# EAGLE schematic SmartTraffic (EAGLE 9.6.2)
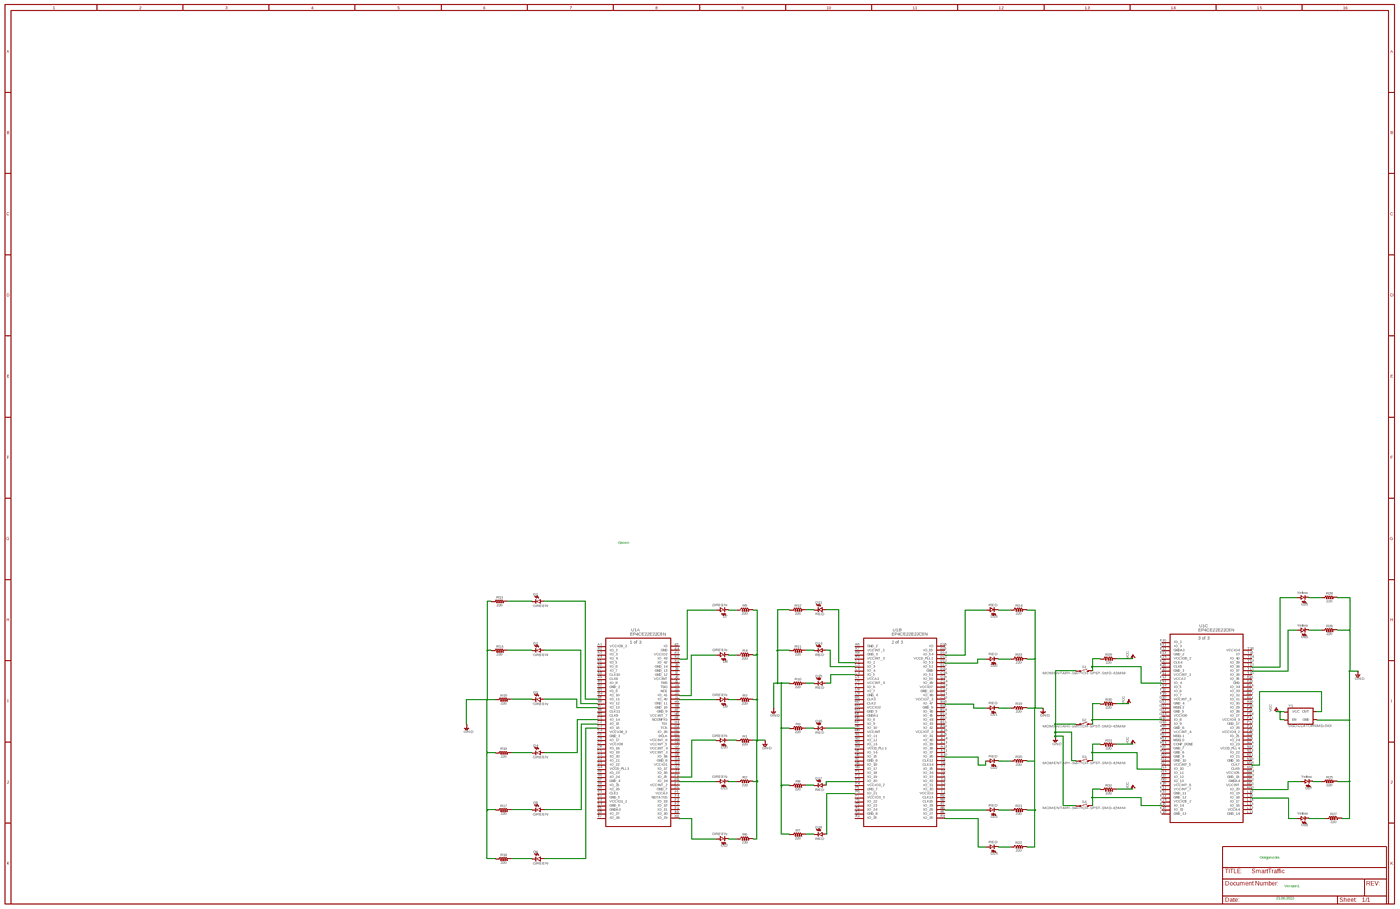
[diagram p0: schematic, sheet 1, overview]
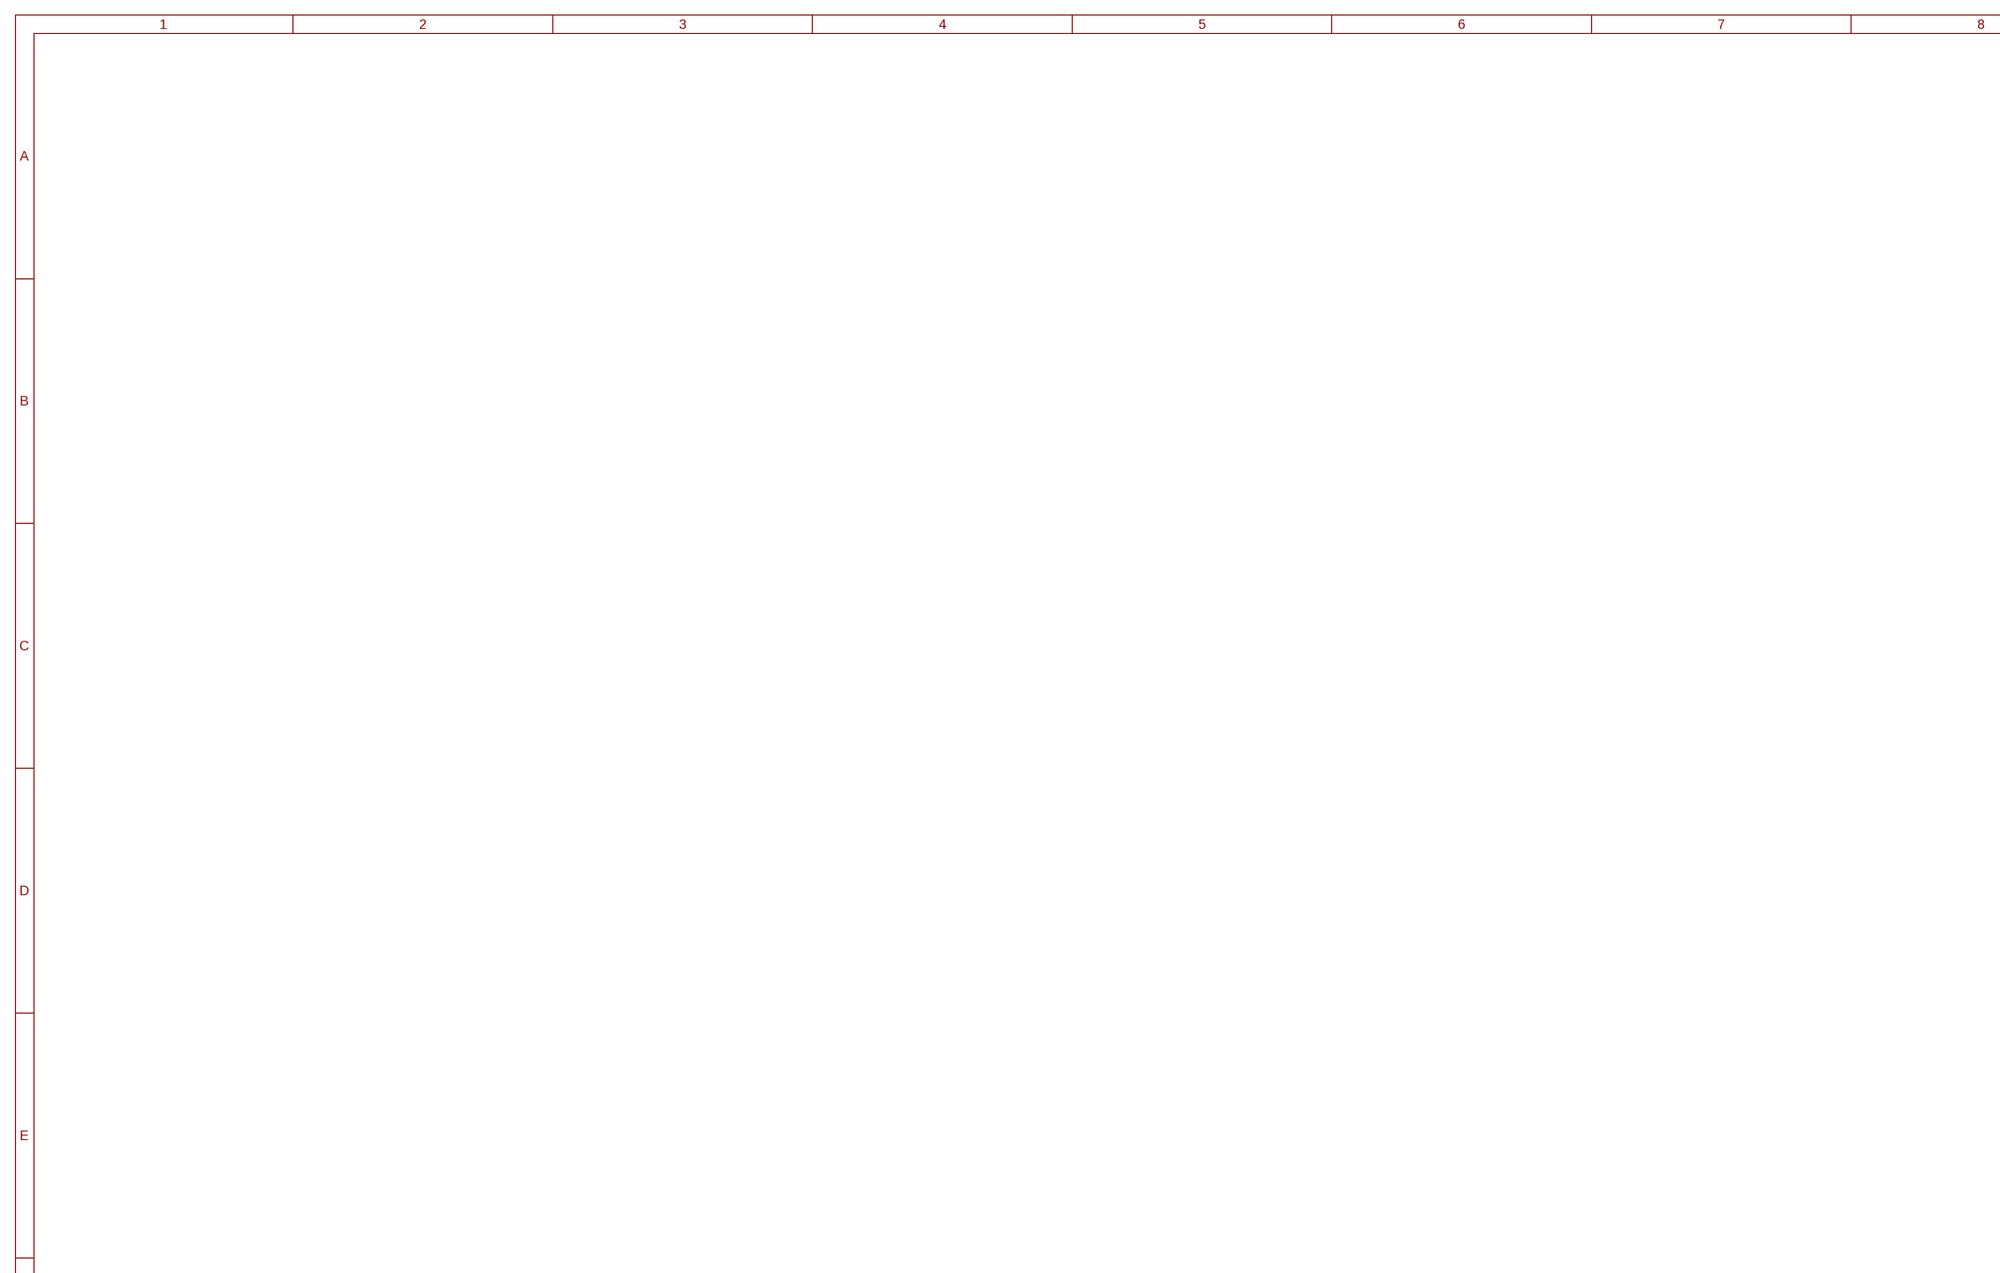
[diagram p1: schematic, sheet 1, part 1 of 4]
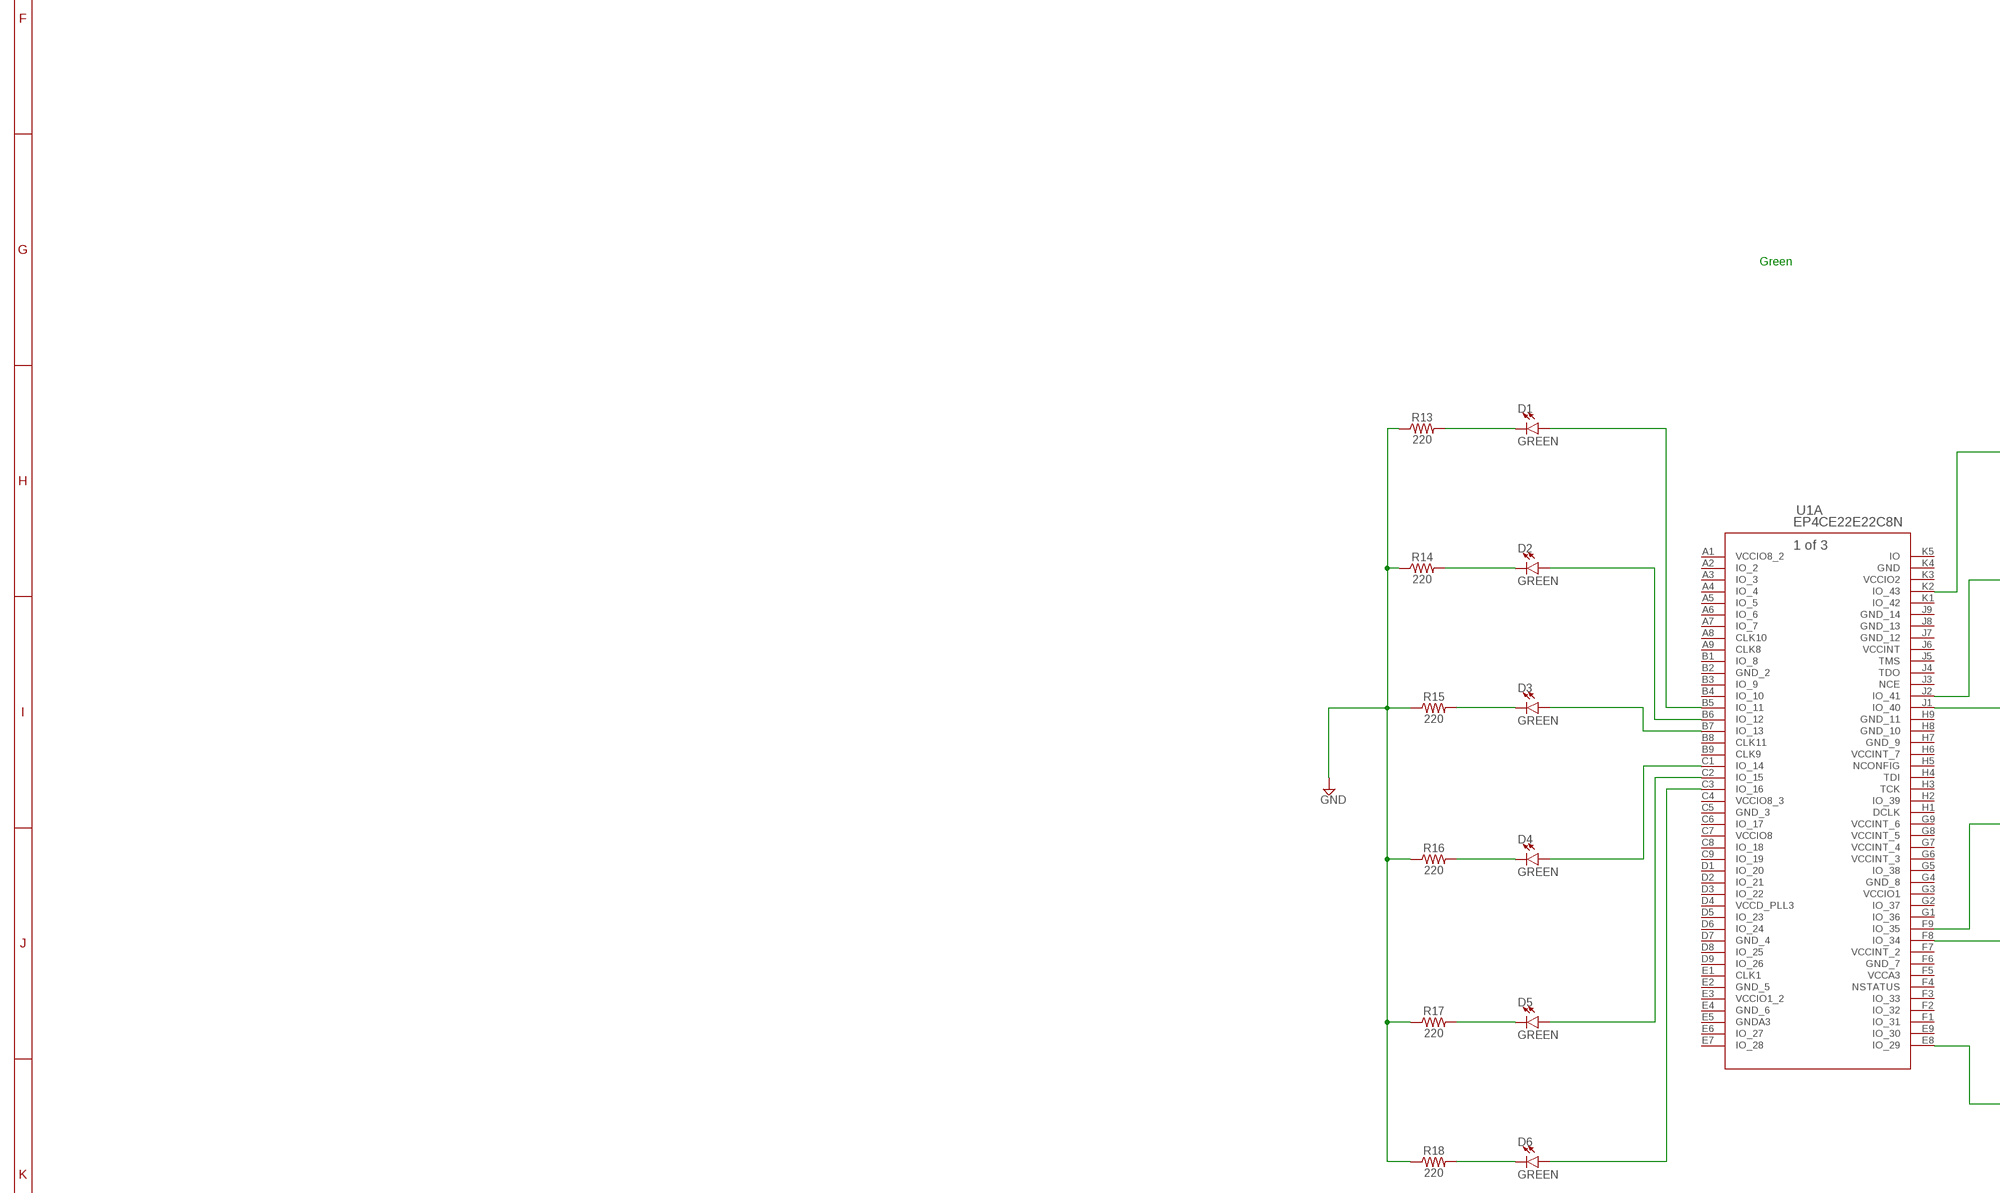
[diagram p2: schematic, sheet 1, part 2 of 4]
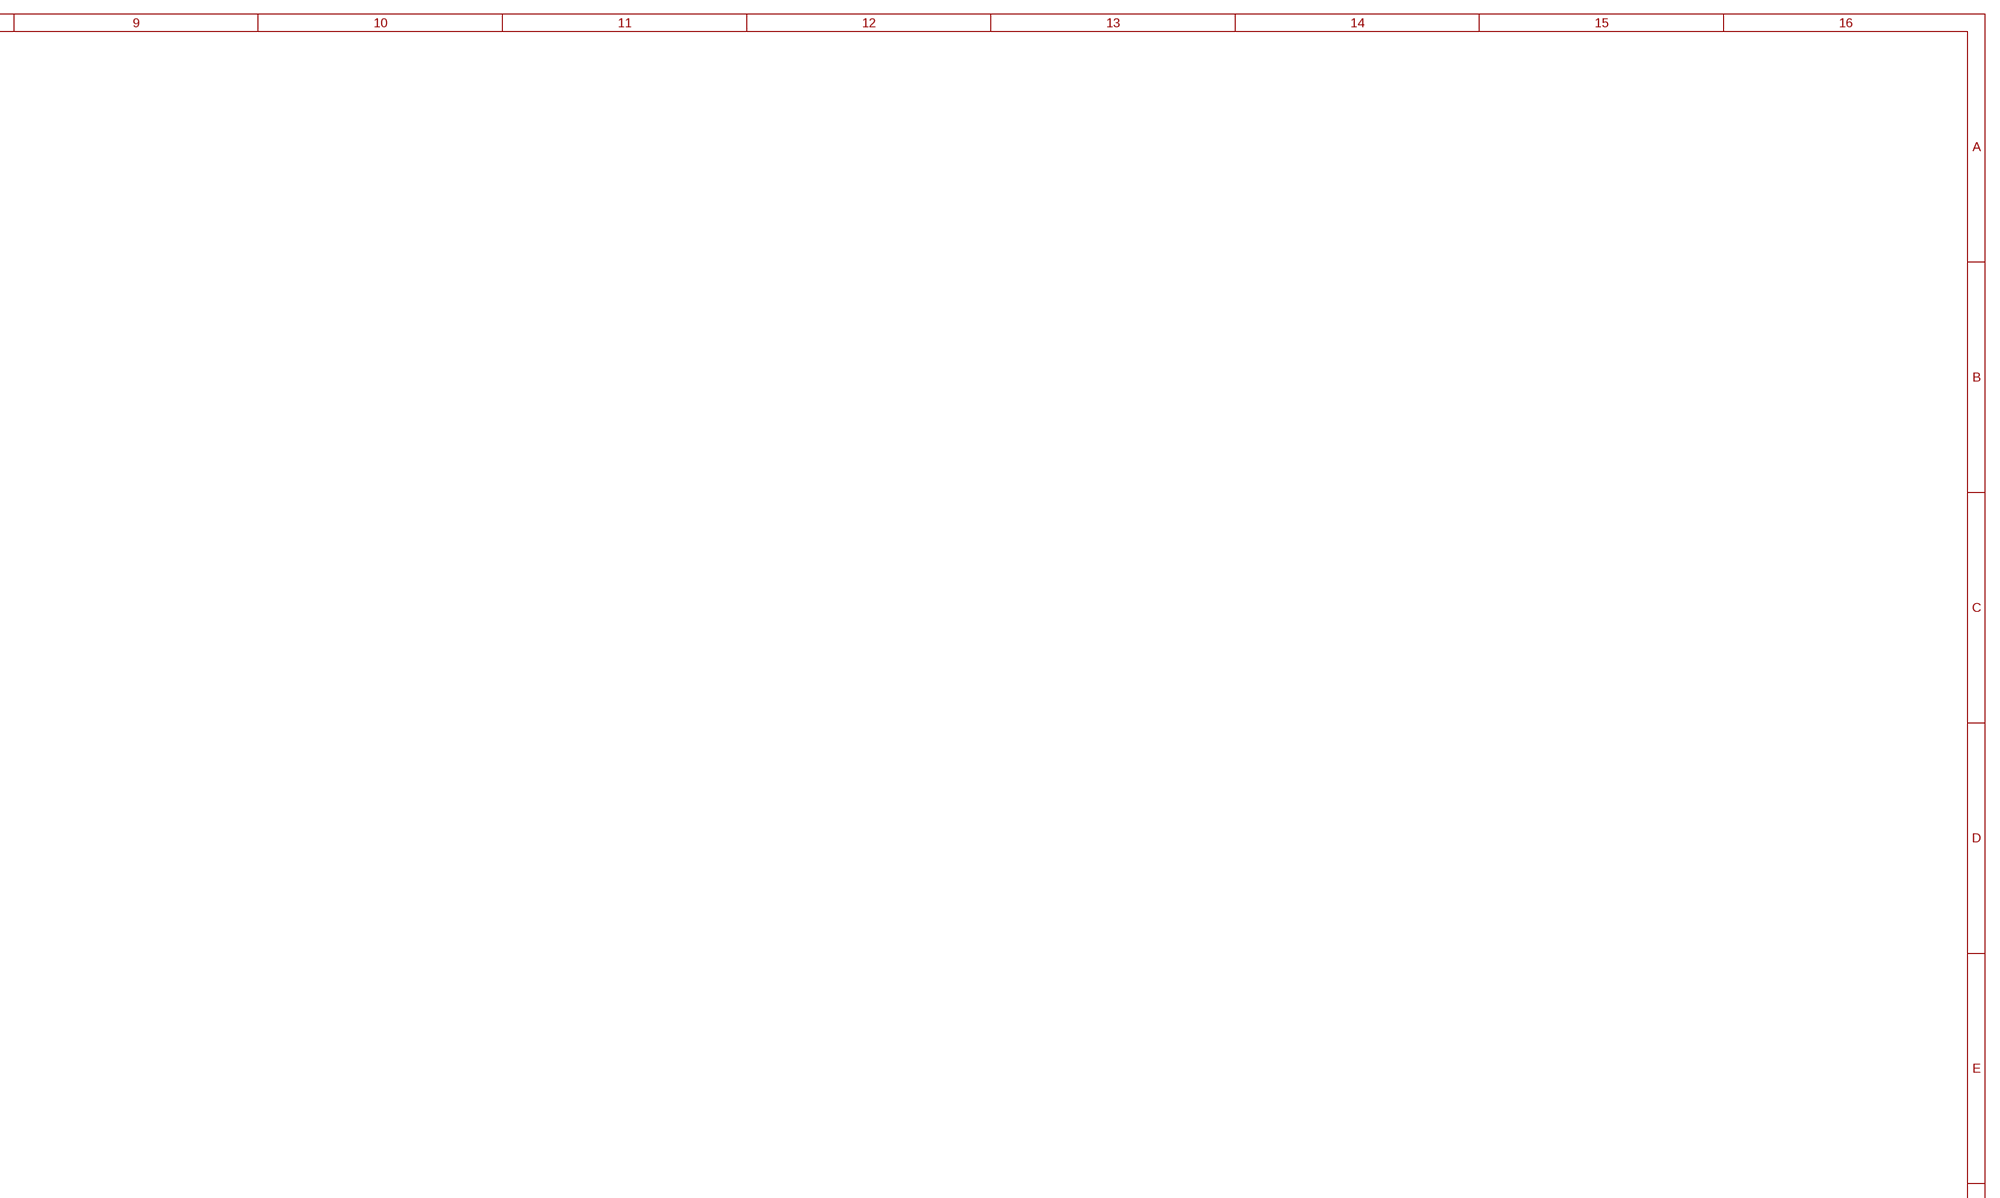
[diagram p3: schematic, sheet 1, part 3 of 4]
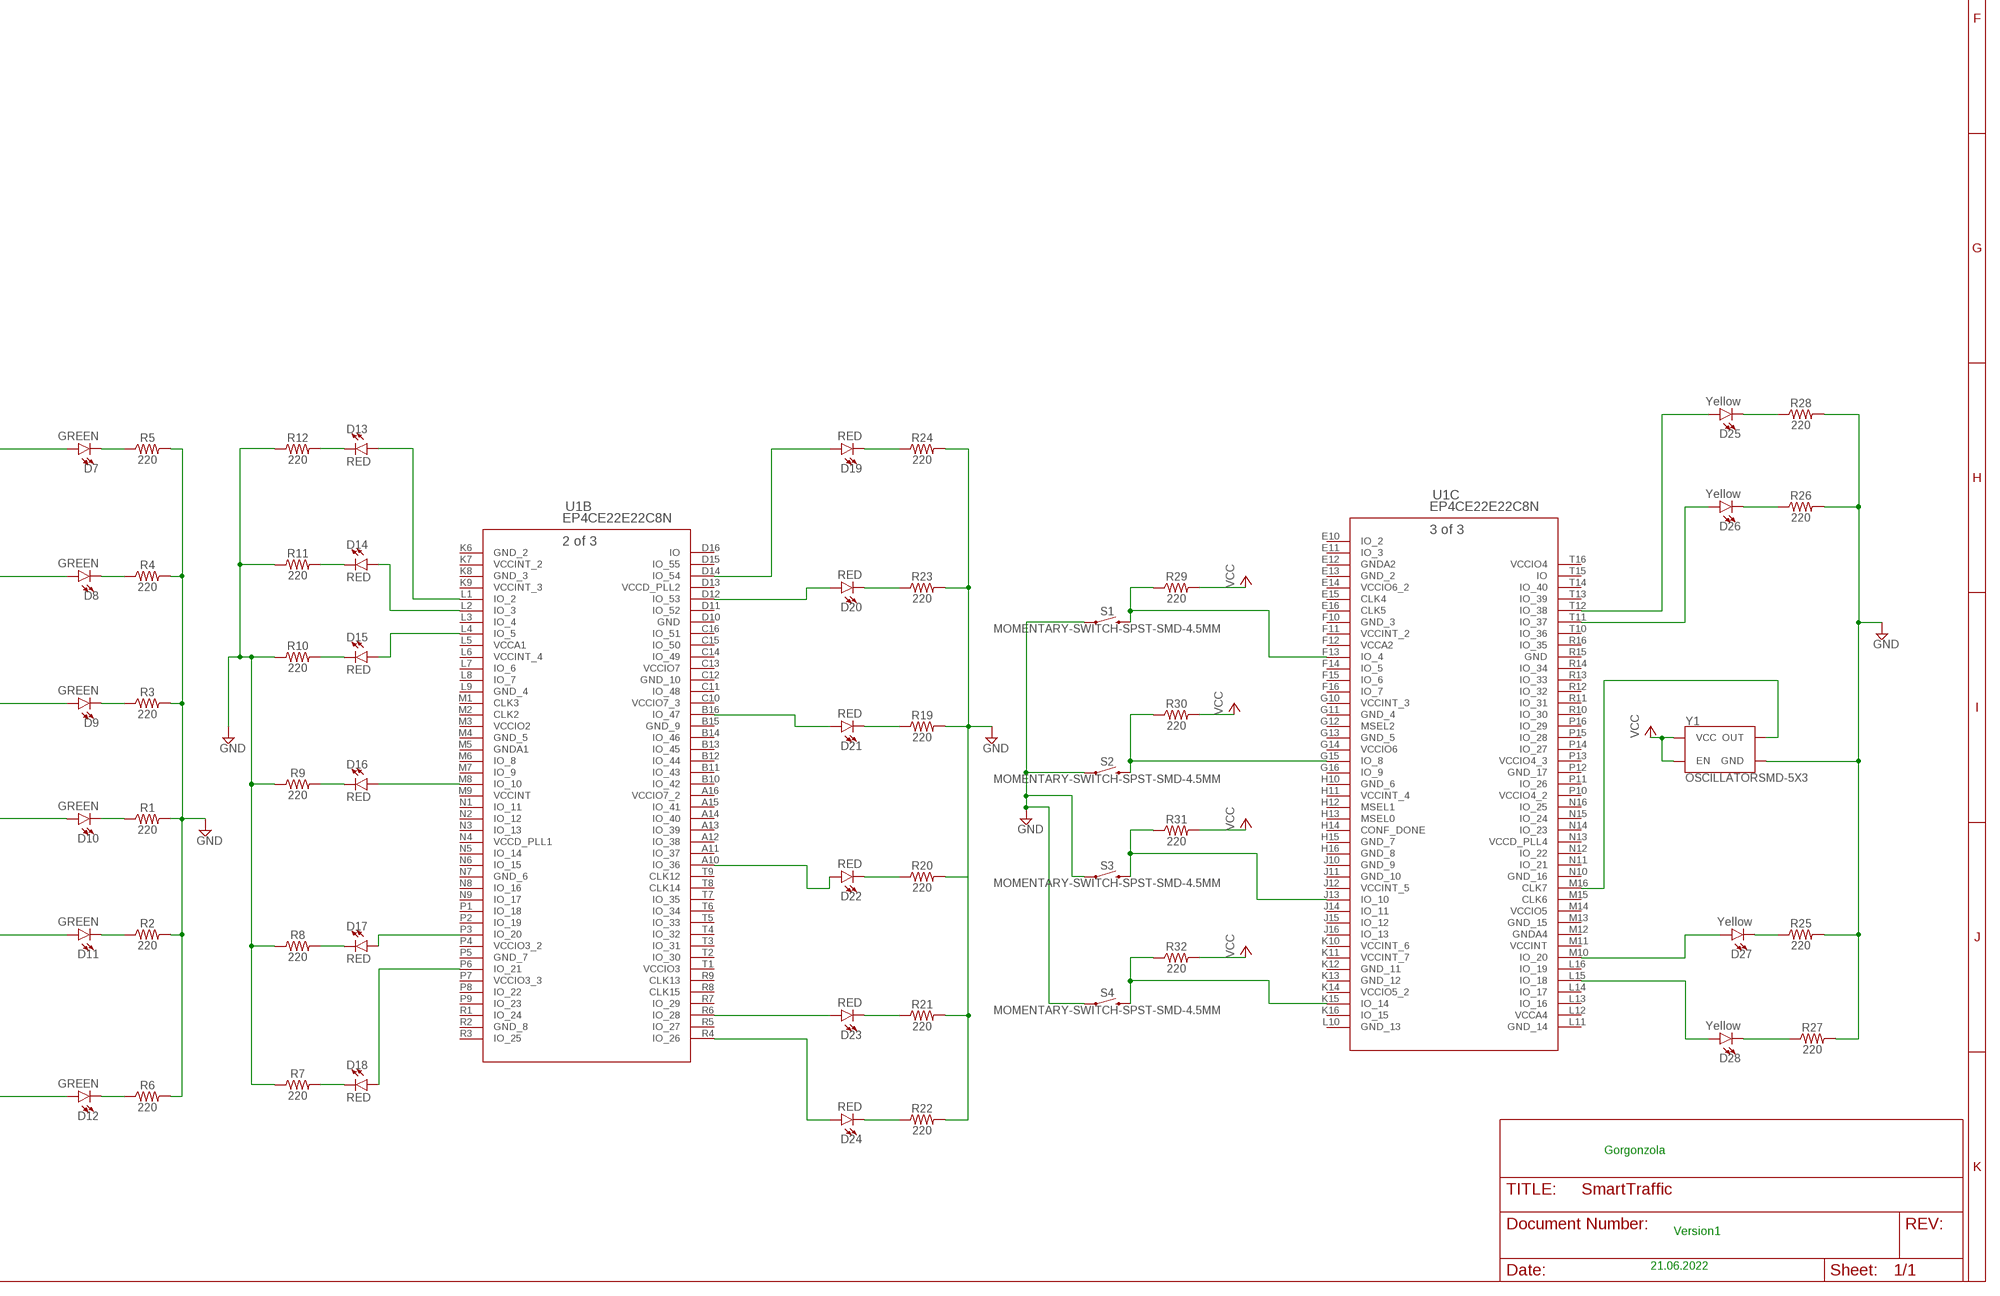
[diagram p4: schematic, sheet 1, part 4 of 4]

## Parts
D1  GREEN  LED-GREEN0603  [LED-0603]
D2  GREEN  LED-GREEN0603  [LED-0603]
D3  GREEN  LED-GREEN0603  [LED-0603]
D4  GREEN  LED-GREEN0603  [LED-0603]
D5  GREEN  LED-GREEN0603  [LED-0603]
D6  GREEN  LED-GREEN0603  [LED-0603]
D7  GREEN  LED-GREEN0603  [LED-0603]
D8  GREEN  LED-GREEN0603  [LED-0603]
D9  GREEN  LED-GREEN0603  [LED-0603]
D10  GREEN  LED-GREEN0603  [LED-0603]
D11  GREEN  LED-GREEN0603  [LED-0603]
D12  GREEN  LED-GREEN0603  [LED-0603]
D13  RED  LED-RED0603  [LED-0603]
D14  RED  LED-RED0603  [LED-0603]
D15  RED  LED-RED0603  [LED-0603]
D16  RED  LED-RED0603  [LED-0603]
D17  RED  LED-RED0603  [LED-0603]
D18  RED  LED-RED0603  [LED-0603]
D19  RED  LED-RED0603  [LED-0603]
D20  RED  LED-RED0603  [LED-0603]
D21  RED  LED-RED0603  [LED-0603]
D22  RED  LED-RED0603  [LED-0603]
D23  RED  LED-RED0603  [LED-0603]
D24  RED  LED-RED0603  [LED-0603]
D25  Yellow  LED-YELLOW0603  [LED-0603]
D26  Yellow  LED-YELLOW0603  [LED-0603]
D27  Yellow  LED-YELLOW0603  [LED-0603]
D28  Yellow  LED-YELLOW0603  [LED-0603]
R1  220  0.22OHM-0805-1/4W-1%  [0805]
R2  220  0.22OHM-0805-1/4W-1%  [0805]
R3  220  0.22OHM-0805-1/4W-1%  [0805]
R4  220  0.22OHM-0805-1/4W-1%  [0805]
R5  220  0.22OHM-0805-1/4W-1%  [0805]
R6  220  0.22OHM-0805-1/4W-1%  [0805]
R7  220  0.22OHM-0805-1/4W-1%  [0805]
R8  220  0.22OHM-0805-1/4W-1%  [0805]
R9  220  0.22OHM-0805-1/4W-1%  [0805]
R10  220  0.22OHM-0805-1/4W-1%  [0805]
R11  220  0.22OHM-0805-1/4W-1%  [0805]
R12  220  0.22OHM-0805-1/4W-1%  [0805]
R13  220  0.22OHM-0805-1/4W-1%  [0805]
R14  220  0.22OHM-0805-1/4W-1%  [0805]
R15  220  0.22OHM-0805-1/4W-1%  [0805]
R16  220  0.22OHM-0805-1/4W-1%  [0805]
R17  220  0.22OHM-0805-1/4W-1%  [0805]
R18  220  0.22OHM-0805-1/4W-1%  [0805]
R19  220  0.22OHM-0805-1/4W-1%  [0805]
R20  220  0.22OHM-0805-1/4W-1%  [0805]
R21  220  0.22OHM-0805-1/4W-1%  [0805]
R22  220  0.22OHM-0805-1/4W-1%  [0805]
R23  220  0.22OHM-0805-1/4W-1%  [0805]
R24  220  0.22OHM-0805-1/4W-1%  [0805]
R25  220  0.22OHM-0805-1/4W-1%  [0805]
R26  220  0.22OHM-0805-1/4W-1%  [0805]
R27  220  0.22OHM-0805-1/4W-1%  [0805]
R28  220  0.22OHM-0805-1/4W-1%  [0805]
R29  220  0.22OHM-0805-1/4W-1%  [0805]
R30  220  0.22OHM-0805-1/4W-1%  [0805]
R31  220  0.22OHM-0805-1/4W-1%  [0805]
R32  220  0.22OHM-0805-1/4W-1%  [0805]
S1  MOMENTARY-SWITCH-SPST-SMD-4.5MM  [TACTILE_SWITCH_SMD_4.5MM]
S2  MOMENTARY-SWITCH-SPST-SMD-4.5MM  [TACTILE_SWITCH_SMD_4.5MM]
S3  MOMENTARY-SWITCH-SPST-SMD-4.5MM  [TACTILE_SWITCH_SMD_4.5MM]
S4  MOMENTARY-SWITCH-SPST-SMD-4.5MM  [TACTILE_SWITCH_SMD_4.5MM]
U1  EP4CE22E22C8N  [FBGA256_THIN_WIRE-BOND-A:1.55_]
Y1  OSCILLATORSMD-5X3  [OSCILLATOR-SMD-5X3.2]

## Nets
GND: R1.2 R2.2 R3.2 R4.2 R5.2 R6.2 R7.1 R8.1 R9.1 R10.1 R11.1 R12.1 R13.1 R14.1 R15.1 R16.1 R17.1 R18.1 R19.2 R20.2 R21.2 R22.2 R23.2 R24.2 R25.2 R26.2 R27.2 R28.2 S1.2 S1.3 S2.2 S2.3 S3.2 S3.3 S4.2 S4.3 Y1.2(GND)
N$1: D10.A U1.F9(A:IO_35)
N$2: D10.C R1.1
N$3: D3.A U1.B7(A:IO_13)
N$4: D3.C R15.2
N$5: D4.A U1.C1(A:IO_14)
N$6: D5.A U1.C2(A:IO_15)
N$7: D2.A U1.B6(A:IO_12)
N$8: D1.A U1.B5(A:IO_11)
N$9: D6.A U1.C3(A:IO_16)
N$10: D1.C R13.2
N$11: D2.C R14.2
N$12: D4.C R16.2
N$13: D5.C R17.2
N$14: D6.C R18.2
N$15: D11.A U1.F8(A:IO_34)
N$16: D12.A U1.E8(A:IO_29)
N$17: D12.C R6.1
N$18: D9.A U1.J1(A:IO_40)
N$19: D8.A U1.J2(A:IO_41)
N$20: D11.C R2.1
N$21: D9.C R3.1
N$22: D8.C R4.1
N$23: D7.C R5.1
N$24: D7.A U1.K2(A:IO_43)
N$25: D27.C R25.1
N$26: D27.A U1.M10(C:IO_20)
N$27: D25.A U1.T12(C:IO_38)
N$28: R29.1 S1.1 S1.4 U1.F13(C:IO_4)
N$29: R30.1 S2.1 S2.4 U1.G15(C:IO_8)
N$30: D16.A U1.M8(B:IO_10)
N$31: D17.A U1.P3(B:IO_20)
N$32: D18.A U1.P6(B:IO_21)
N$33: D15.A U1.L4(B:IO_5)
N$34: D14.A U1.L2(B:IO_3)
N$35: D13.A U1.L1(B:IO_2)
N$36: D13.C R12.2
N$37: D14.C R11.2
N$38: D15.C R10.2
N$39: D16.C R9.2
N$40: D17.C R8.2
N$41: D18.C R7.2
N$42: R31.1 S3.1 S3.4 U1.J13(C:IO_10)
N$43: R32.1 S4.1 S4.4 U1.K15(C:IO_14)
N$44: D26.A U1.T11(C:IO_37)
N$45: D24.A U1.R4(B:IO_26)
N$46: D23.A U1.R6(B:IO_28)
N$47: D22.A U1.A10(B:IO_36)
N$48: D21.A U1.B16(B:IO_47)
N$49: D20.A U1.D12(B:IO_53)
N$50: D19.A U1.D14(B:IO_54)
N$51: D22.C R20.1
N$52: D23.C R21.1
N$53: D24.C R22.1
N$54: D21.C R19.1
N$55: D20.C R23.1
N$56: D26.C R26.1
N$57: D19.C R24.1
N$58: U1.M16(C:CLK7) Y1.3(OUT)
N$64: D28.A U1.L15(C:IO_18)
N$65: D28.C R27.1
N$68: D25.C R28.1
VCC: R29.2 R30.2 R31.2 R32.2 Y1.1(EN) Y1.4(VCC)
Unconnected: U1.A2(A:IO_2) U1.A3(A:IO_3) U1.A4(A:IO_4) U1.A5(A:IO_5) U1.A6(A:IO_6) U1.A7(A:IO_7) U1.A8(A:CLK10) U1.A9(A:CLK8) U1.A11(B:IO_37) U1.A12(B:IO_38) U1.A13(B:IO_39) U1.A14(B:IO_40) U1.A15(B:IO_41) U1.B1(A:IO_8) U1.B2(A:GND_2) U1.B3(A:IO_9) U1.B4(A:IO_10) U1.B8(A:CLK11) U1.B9(A:CLK9) U1.B10(B:IO_42) U1.B11(B:IO_43) U1.B12(B:IO_44) U1.B13(B:IO_45) U1.B14(B:IO_46) U1.B15(B:GND_9) U1.C5(A:GND_3) U1.C6(A:IO_17) U1.C8(A:IO_18) U1.C9(A:IO_19) U1.C11(B:IO_48) U1.C12(B:GND_10) U1.C14(B:IO_49) U1.C15(B:IO_50) U1.C16(B:IO_51) U1.D1(A:IO_20) U1.D2(A:IO_21) U1.D3(A:IO_22) U1.D5(A:IO_23) U1.D6(A:IO_24) U1.D7(A:GND_4) U1.D8(A:IO_25) U1.D9(A:IO_26) U1.D10(B:GND) U1.D11(B:IO_52) U1.D15(B:IO_55) U1.D16(B:IO) U1.E1(A:CLK1) U1.E2(A:GND_5) U1.E4(A:GND_6) U1.E5(A:GNDA3) U1.E6(A:IO_27) U1.E7(A:IO_28) U1.E9(A:IO_30) U1.E10(C:IO_2) U1.E11(C:IO_3) U1.E12(C:GNDA2) U1.E13(C:GND_2) U1.E15(C:CLK4) U1.E16(C:CLK5) U1.F1(A:IO_31) U1.F2(A:IO_32) U1.F3(A:IO_33) U1.F4(A:NSTATUS) U1.F6(A:GND_7) U1.F10(C:GND_3) U1.F14(C:IO_5) U1.F15(C:IO_6) U1.F16(C:IO_7) U1.G1(A:IO_36) U1.G2(A:IO_37) U1.G4(A:GND_8) U1.G5(A:IO_38) U1.G11(C:GND_4) U1.G12(C:MSEL2) U1.G13(C:GND_5) U1.G16(C:IO_9) U1.H1(A:DCLK) U1.H2(A:IO_39) U1.H3(A:TCK) U1.H4(A:TDI) U1.H5(A:NCONFIG) U1.H7(A:GND_9) U1.H8(A:GND_10) U1.H9(A:GND_11) U1.H10(C:GND_6) U1.H12(C:MSEL1) U1.H13(C:MSEL0) U1.H14(C:CONF_DONE) U1.H15(C:GND_7) U1.H16(C:GND_8) U1.J3(A:NCE) U1.J4(A:TDO) U1.J5(A:TMS) U1.J7(A:GND_12) U1.J8(A:GND_13) U1.J9(A:GND_14) U1.J10(C:GND_9) U1.J11(C:GND_10) U1.J14(C:IO_11) U1.J15(C:IO_12) U1.J16(C:IO_13) U1.K1(A:IO_42) U1.K4(A:GND) U1.K5(A:IO) U1.K6(B:GND_2) U1.K8(B:GND_3) U1.K12(C:GND_11) U1.K13(C:GND_12) U1.K16(C:IO_15) U1.L3(B:IO_4) U1.L7(B:IO_6) U1.L8(B:IO_7) U1.L9(B:GND_4) U1.L10(C:GND_13) U1.L11(C:GND_14) U1.L13(C:IO_16) U1.L14(C:IO_17) U1.L16(C:IO_19) U1.M1(B:CLK3) U1.M2(B:CLK2) U1.M4(B:GND_5) U1.M5(B:GNDA1) U1.M6(B:IO_8) U1.M7(B:IO_9) U1.M12(C:GNDA4) U1.M13(C:GND_15) U1.M15(C:CLK6) U1.N1(B:IO_11) U1.N2(B:IO_12) U1.N3(B:IO_13) U1.N5(B:IO_14) U1.N6(B:IO_15) U1.N7(B:GND_6) U1.N8(B:IO_16) U1.N9(B:IO_17) U1.N10(C:GND_16) U1.N11(C:IO_21) U1.N12(C:IO_22) U1.N14(C:IO_23) U1.N15(C:IO_24) U1.N16(C:IO_25) U1.P1(B:IO_18) U1.P2(B:IO_19) U1.P5(B:GND_7) U1.P8(B:IO_22) U1.P9(B:IO_23) U1.P11(C:IO_26) U1.P12(C:GND_17) U1.P14(C:IO_27) U1.P15(C:IO_28) U1.P16(C:IO_29) U1.R1(B:IO_24) U1.R2(B:GND_8) U1.R3(B:IO_25) U1.R5(B:IO_27) U1.R7(B:IO_29) U1.R8(B:CLK15) U1.R9(B:CLK13) U1.R10(C:IO_30) U1.R11(C:IO_31) U1.R12(C:IO_32) U1.R13(C:IO_33) U1.R14(C:IO_34) U1.R15(C:GND) U1.R16(C:IO_35) U1.T2(B:IO_30) U1.T3(B:IO_31) U1.T4(B:IO_32) U1.T5(B:IO_33) U1.T6(B:IO_34) U1.T7(B:IO_35) U1.T8(B:CLK14) U1.T9(B:CLK12) U1.T10(C:IO_36) U1.T13(C:IO_39) U1.T14(C:IO_40) U1.T15(C:IO)

## Notes on the sheet
- Green
- Gorgonzola
- Version1
- 21.06.2022

## Power pins joined to a net without a drawn wire
VCCA1: U1.L5(B:VCCA1)
VCCA2: U1.F12(C:VCCA2)
VCCA3: U1.F5(A:VCCA3)
VCCA4: U1.L12(C:VCCA4)
VCCD_PLL1: U1.N4(B:VCCD_PLL1)
VCCD_PLL2: U1.D13(B:VCCD_PLL2)
VCCD_PLL3: U1.D4(A:VCCD_PLL3)
VCCD_PLL4: U1.N13(C:VCCD_PLL4)
VCCINT: U1.J6(A:VCCINT) U1.M9(B:VCCINT) U1.M11(C:VCCINT)
VCCINT_2: U1.F7(A:VCCINT_2) U1.F11(C:VCCINT_2) U1.K7(B:VCCINT_2)
VCCINT_3: U1.G6(A:VCCINT_3) U1.G10(C:VCCINT_3) U1.K9(B:VCCINT_3)
VCCINT_4: U1.G7(A:VCCINT_4) U1.H11(C:VCCINT_4) U1.L6(B:VCCINT_4)
VCCINT_5: U1.G8(A:VCCINT_5) U1.J12(C:VCCINT_5)
VCCINT_6: U1.G9(A:VCCINT_6) U1.K10(C:VCCINT_6)
VCCINT_7: U1.H6(A:VCCINT_7) U1.K11(C:VCCINT_7)
VCCIO1: U1.G3(A:VCCIO1)
VCCIO1_2: U1.E3(A:VCCIO1_2)
VCCIO2: U1.K3(A:VCCIO2) U1.M3(B:VCCIO2)
VCCIO3: U1.T1(B:VCCIO3)
VCCIO3_2: U1.P4(B:VCCIO3_2)
VCCIO3_3: U1.P7(B:VCCIO3_3)
VCCIO4: U1.T16(C:VCCIO4)
VCCIO4_2: U1.P10(C:VCCIO4_2)
VCCIO4_3: U1.P13(C:VCCIO4_3)
VCCIO5: U1.M14(C:VCCIO5)
VCCIO5_2: U1.K14(C:VCCIO5_2)
VCCIO6: U1.G14(C:VCCIO6)
VCCIO6_2: U1.E14(C:VCCIO6_2)
VCCIO7: U1.C13(B:VCCIO7)
VCCIO7_2: U1.A16(B:VCCIO7_2)
VCCIO7_3: U1.C10(B:VCCIO7_3)
VCCIO8: U1.C7(A:VCCIO8)
VCCIO8_2: U1.A1(A:VCCIO8_2)
VCCIO8_3: U1.C4(A:VCCIO8_3)

## Library data of the parts
D1-D12 = SparkFun-LED:LED-GREEN: Green SMD LED Used in manufacturing of various products at SparkFun Packages: 0603 - SMD 0603 package [Product Link] <http://www.futureelectronics.com/en/technologies/semiconductors/optoelectronics/leds/Pages/9894312-LTST-C190GKT.aspx?CrossPart=HSMG-C190&IM=0> LilyPad 1206 - SMD1206 LilyPad package [Product Link] <http://www.futureelectronics.com/en/Technologies/Product.aspx?ProductID=IN150NGHARVATEKCORPORATION2049943&IM=0> 1206 - SMD1206 package [Product Link] <http://www.futureelectronics.com/en/technologies/semiconductors/optoelectronics/leds/Pages/8315665-LTST-C150KGKT.aspx?IM=0> 1206 Bottom Mount -SMD 1206 Bottom Mount [Product Link] <http://www.digikey.com/product-detail/en/lite-on-inc/LTST-C230KGKT/160-1456-1-ND/386854> SparkFun Products: Pro Mini 328 -5V <https://www.sparkfun.com/products/821> RedBoard <https://www.sparkfun.com/products/12757> MP3 Trigger <https://www.sparkfun.com/products/13720> Makey Makey <https://www.sparkfun.com/products/11076>; PROD_ID: DIO-00821
D13-D24 = SparkFun-LED:LED-RED: Red SMD LED Used in manufacturing of most products at SparkFun Packages: 0603 - SMD 0603 package [Product Link] <http://docs.avagotech.com/docs/AV02-0551EN> 0603 SMART - SMD 0603 SMART package ( more efficient and expensive)[Product Link] <http://www.osram-os.com/Graphics/XPic2/00077099_0.pdf> 1206 - SMD1206 package [Product Link] <https://www.sparkfun.com/datasheets/DevTools/LilyPad/Q150OVS4.pdff> SparkFun Products: Pro Mini 328 -5V <https://www.sparkfun.com/products/821> RedBoard <https://www.sparkfun.com/products/12757> IOIO-OTG <https://www.sparkfun.com/products/13613>; PROD_ID: DIO-00819
D25-D28 = SparkFun-LED:LED-YELLOW: Yellow SMD LED Used in manufacturing several products at SparkFun. Packages: 0603 - SMD 0603 package[Product Link] <http://www.kingbrightusa.com/product.asp?catalog_name=LED&product_id=APT1608SYCK> 0603 -SMART - SMART SMD 0603 package (more efficient/more expensive) [Product Link] <http://www.osram-os.com/osram_os/en/products/product-catalog/led-light-emitting-diodes/smartled-0603/ly-l29k/index.jsp> LilyPad - SMD1206 package[Product Datasheet] <https://www.sparkfun.com/datasheets/DevTools/LilyPad/Q150YUS4.pdf> SparkFun Products: Blynk Board <https://www.sparkfun.com/products/13794> IOIO-OTG <https://www.sparkfun.com/products/13613> XBee Explorer Serial <https://www.sparkfun.com/products/13225>; PROD_ID: DIO-09003
R1-R32 = SparkFun-Resistors:0.22OHM: 0.22Ω resistor A resistor is a passive two-terminal electrical component that implements electrical resistance as a circuit element. Resistors act to reduce current flow, and, at the same time, act to lower voltage levels within circuits. - Wikipedia; PROD_ID: RES-09883; VALUE: 0.22
S1-S4 = SparkFun-Switches:MOMENTARY-SWITCH-SPST: Momentary Switch (Pushbutton) - SPST Normally-open (NO) SPST momentary switches (buttons, pushbuttons). Variants PTH-12MM - 12mm square, through-hole Momentary Pushbutton Switch - 12mm Square <https://www.sparkfun.com/products/9190> (COM-09190) PTH-6.0MM, PTH-6.0MM-KIT - 6.0mm square, through-hole Mini Pushbutton Switch <https://www.sparkfun.com/products/97> (COM-00097) KIT package intended for soldering kit's - only one side of pads' copper is exposed. PTH-RIGHT-ANGLE-KIT - Right-angle, through-hole Right Angle Tactile Button <https://www.sparkfun.com/products/10791> - Used on SparkFun BigTime Watch Kit <https://www.sparkfun.com/products/11734> SMD-12MM - 12mm square, surface-mount Tactile Button - SMD (12mm) <https://www.sparkfun.com/products/12993> (COM-12993) Used on SparkFun PicoBoard <https://www.sparkfun.com/products/11888> SMD-4.5MM - 4.5mm Square Trackball Switch Used on SparkFun Blackberry Trackballer Breakout <https://www.sparkfun.com/products/13169> SMD-4.6MMX2.8MM - 4.60mm x 2.80mm, surface mount Used on SparkFun SAMD21 Mini Breakout <https://www.sparkfun.com/products/13664> SMD-5.2MM, SMD-5.2-REDUNDANT - 5.2mm square, surface-mount Mini Pushbutton Switch - SMD <https://www.sparkfun.com/products/8720> (COM-08720) Used on Arduino Pro Mini <https://www.sparkfun.com/products/11114> REDUNDANT package connects both switch circuits together SMD-6.0X3.5MM - 6.0 x 3.5mm, surface mount Momentary Reset Switch SMD <https://www.sparkfun.com/products/8229> (COM-08229) SMD-6.2MM-TALL - 6.2mm square, surface mount Tactile Button - SMD (6mm) <https://www.sparkfun.com/products/12992> Used on SparkFun Digital Sandbox <https://www.sparkfun.com/products/12651> SMD-RIGHT-ANGLE - Right-angle, surface mount Used on SparkFun Block for Intel® Edison - Arduino <https://www.sparkfun.com/products/13036>; PROD_ID: SWCH-09213
U1 = untitled:EP4CE22E22C8N; COPYRIGHT: Copyright (C) 2022 Ultra Librarian. All rights reserved.; MANUFACTURER_PART_NUMBER: EP4CE22E22C8N; MFR_NAME: Intel
Y1 = SparkFun-Clocks:OSCILLATOR: Oscillators (Generic) These are active oscillators, which require a power source to generate their clock output. Most oscillators are configured to generate a set frequency (e.g. 16MHz). They have four pins: power, ground, output, and an enable input.